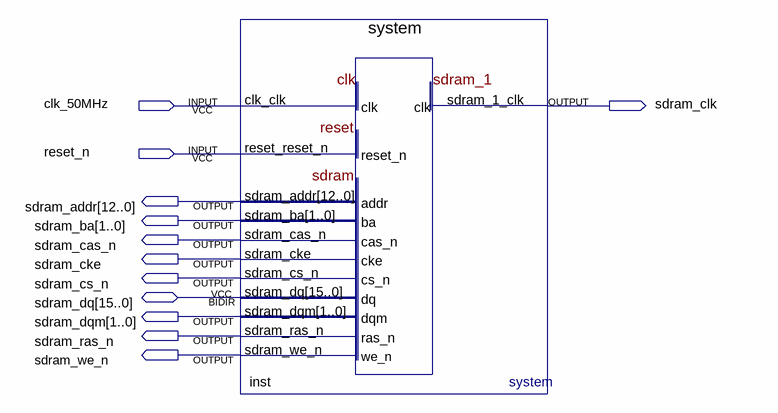
[diagram p0: schematic sheet]
// Quartus schematic ivs_project.bdf as structural Verilog: 1 symbols, 12 pins
module ivs_project (
  input  clk_50MHz,
  input  reset_n,
  inout  [15:0] sdram_dq,
  output sdram_clk,
  output [12:0] sdram_addr,
  output [1:0] sdram_ba,
  output sdram_cas_n,
  output sdram_cke,
  output sdram_cs_n,
  output [1:0] sdram_dqm,
  output sdram_ras_n,
  output sdram_we_n
);

  system inst (
    .clk_clk(clk_50MHz), .reset_reset_n(reset_n), .sdram_addr(sdram_addr), .sdram_ba(sdram_ba),
    .sdram_cas_n(sdram_cas_n), .sdram_cke(sdram_cke), .sdram_cs_n(sdram_cs_n), .sdram_dqm(sdram_dqm),
    .sdram_ras_n(sdram_ras_n), .sdram_we_n(sdram_we_n), .sdram_1_clk(sdram_clk), .sdram_dq(sdram_dq));
endmodule
